# Altium schematic sheet FLUIDIC_CTRL.SchDoc
size 420 x 297 mm; SheetNumber: 17; SheetTotal: 21
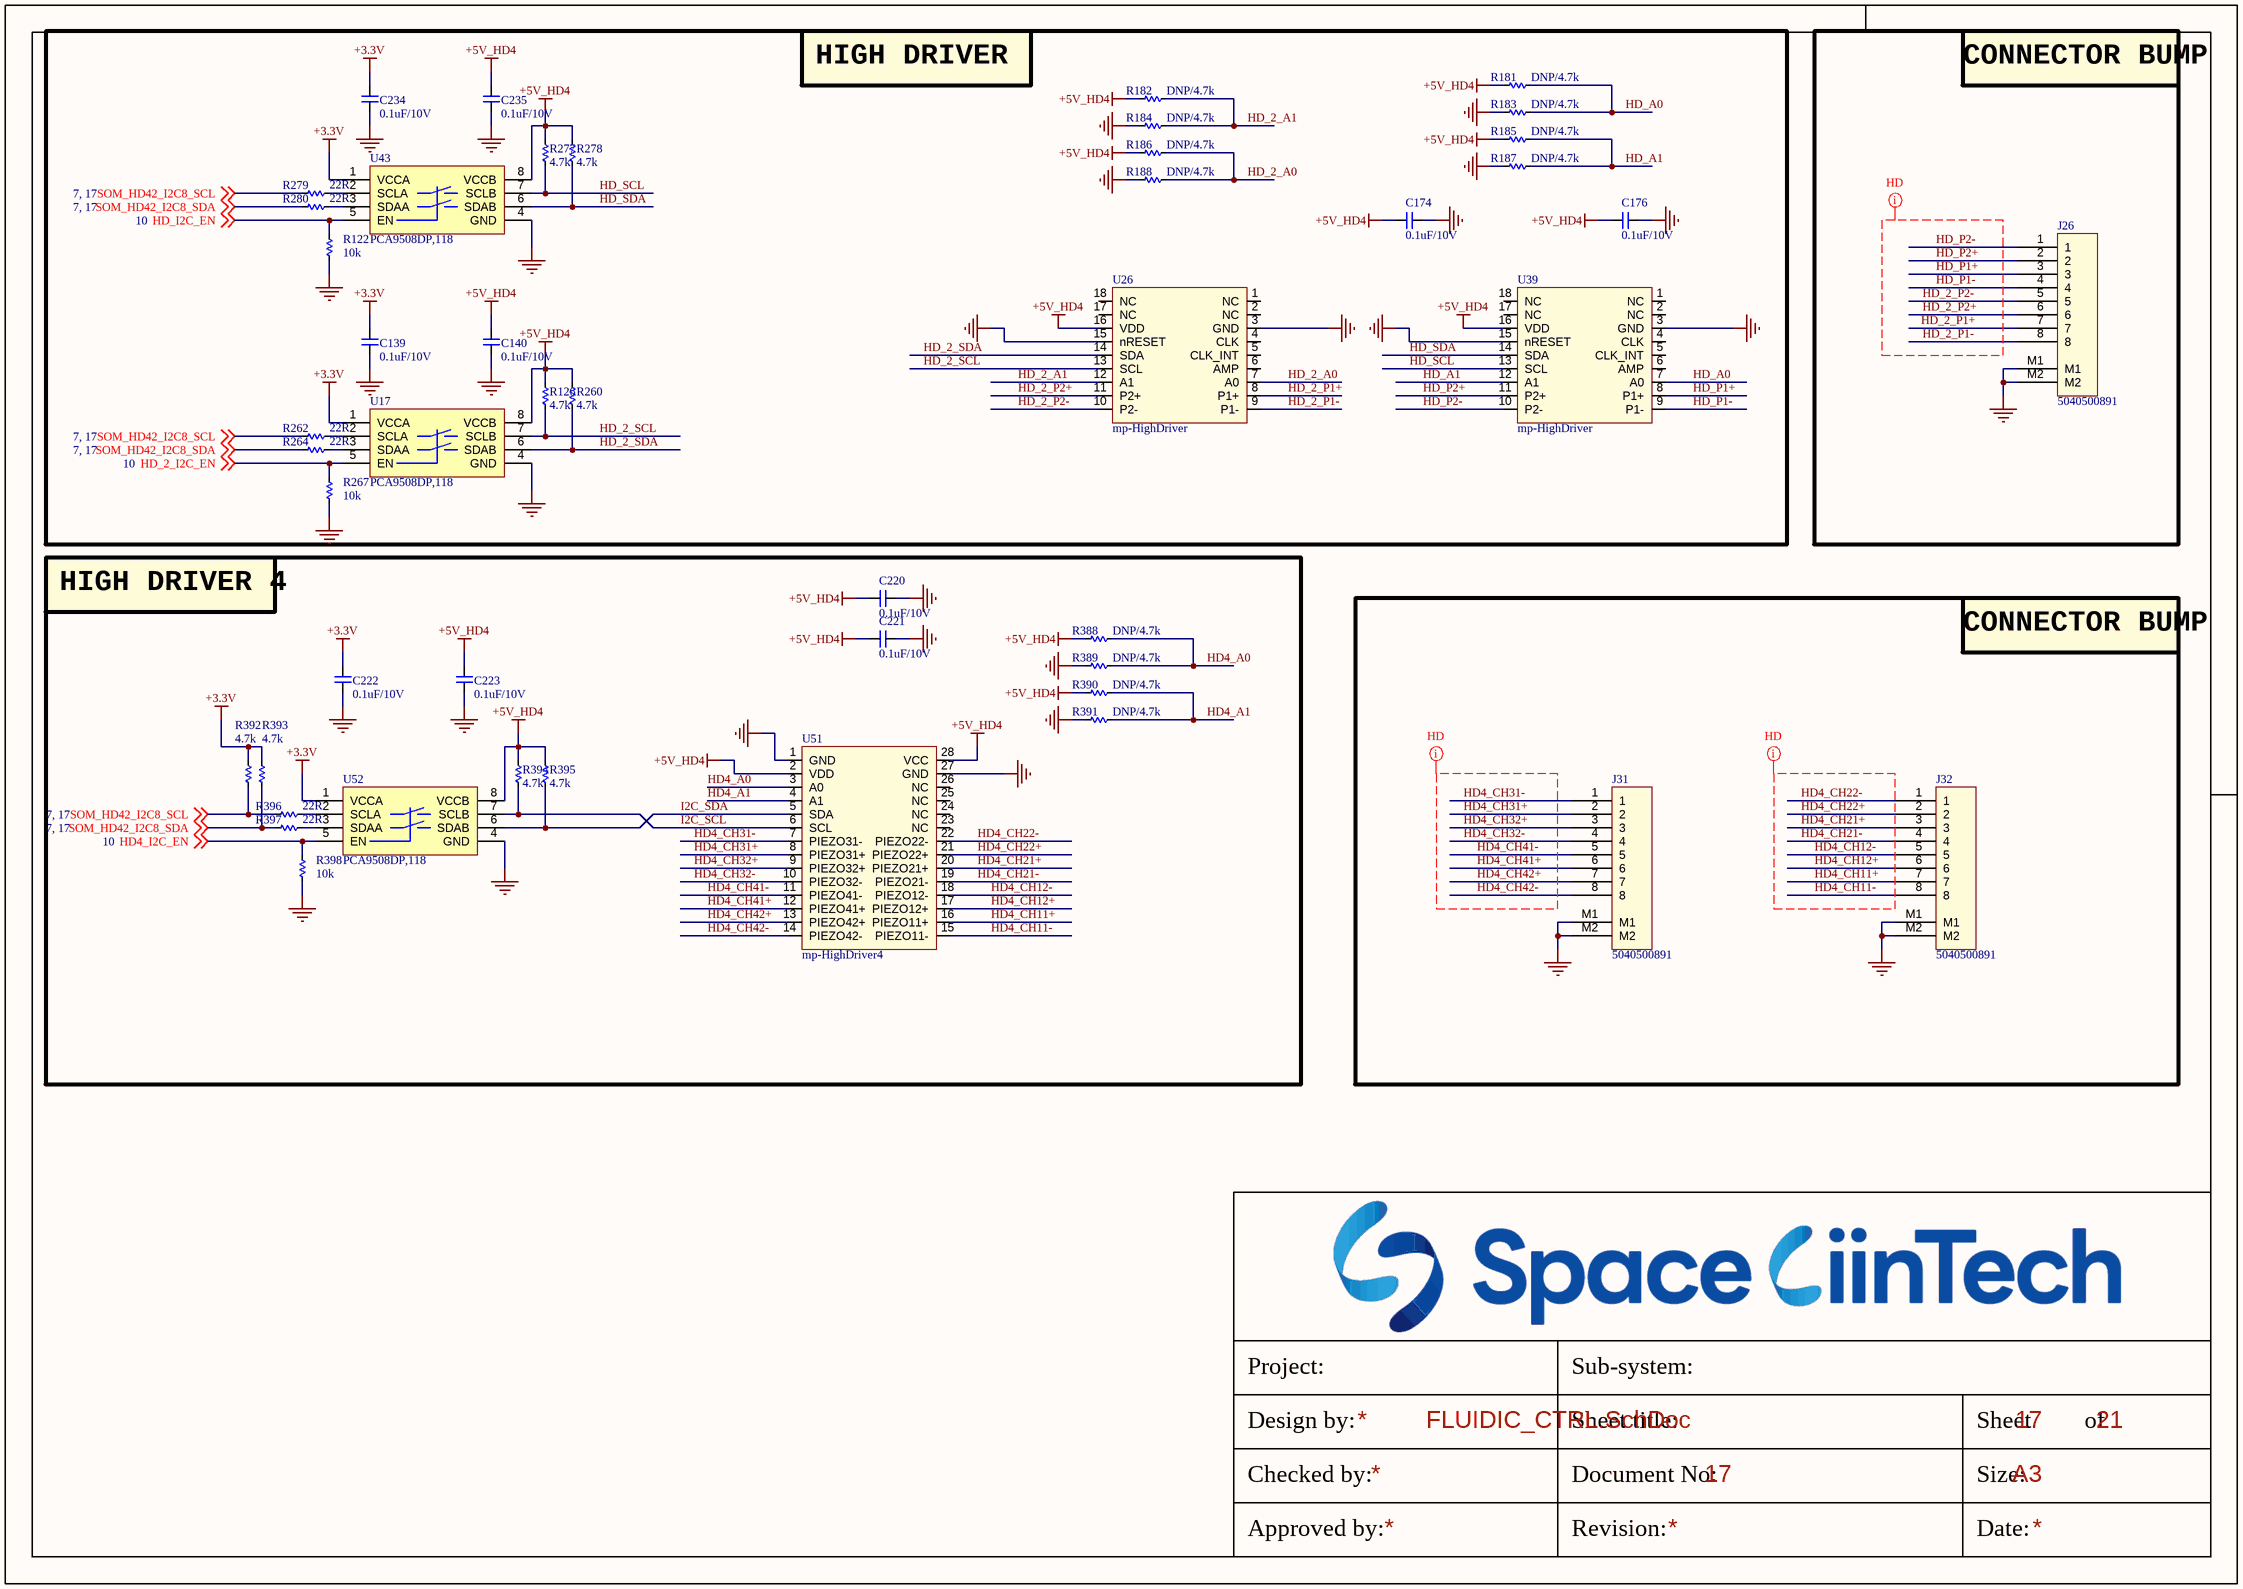
[diagram p0: FLUIDIC_CTRL.SchDoc]

## Parts
C139  0.1uF/10V  [CAP_C_1005X60]
C140  0.1uF/10V  [CAP_C_1005X60]
C174  0.1uF/10V  [CAP_C_1005X60]
C176  0.1uF/10V  [CAP_C_1005X60]
C220  0.1uF/10V  [CAP_C_1005X60]
C221  0.1uF/10V  [CAP_C_1005X60]
C222  0.1uF/10V  [CAP_C_1005X60]
C223  0.1uF/10V  [CAP_C_1005X60]
C234  0.1uF/10V  [CAP_C_1005X60]
C235  0.1uF/10V  [CAP_C_1005X60]
J26  5040500891  [MOLEX_5040500891]
J31  5040500891  [MOLEX_5040500891]
J32  5040500891  [MOLEX_5040500891]
R122  10k  [RES_C_1005X40]
R126  4.7k  [RES_C_1005X40]
R181  DNP/4.7k  [RES_C_1005X40]
R182  DNP/4.7k  [RES_C_1005X40]
R183  DNP/4.7k  [RES_C_1005X40]
R184  DNP/4.7k  [RES_C_1005X40]
R185  DNP/4.7k  [RES_C_1005X40]
R186  DNP/4.7k  [RES_C_1005X40]
R187  DNP/4.7k  [RES_C_1005X40]
R188  DNP/4.7k  [RES_C_1005X40]
R260  4.7k  [RES_C_1005X40]
R262  22R  [RES_C_1005X40]
R264  22R  [RES_C_1005X40]
R267  10k  [RES_C_1005X40]
R277  4.7k  [RES_C_1005X40]
R278  4.7k  [RES_C_1005X40]
R279  22R  [RES_C_1005X40]
R280  22R  [RES_C_1005X40]
R388  DNP/4.7k  [RES_C_1005X40]
R389  DNP/4.7k  [RES_C_1005X40]
R390  DNP/4.7k  [RES_C_1005X40]
R391  DNP/4.7k  [RES_C_1005X40]
R392  4.7k  [RES_C_1005X40]
R393  4.7k  [RES_C_1005X40]
R394  4.7k  [RES_C_1005X40]
R395  4.7k  [RES_C_1005X40]
R396  22R  [RES_C_1005X40]
R397  22R  [RES_C_1005X40]
R398  10k  [RES_C_1005X40]
U17  PCA9508DP,118  [TSOP8]
U26  mp-HighDriver  [MP_HIGHDRIVER]
U39  mp-HighDriver  [MP_HIGHDRIVER]
U43  PCA9508DP,118  [TSOP8]
U51  mp-HighDriver4  [MP_HIGHDRIVER4]
U52  PCA9508DP,118  [TSOP8]

## Blocks framed on the sheet
HIGH DRIVER: C139 C140 C174 C176 C234 C235 R122 R126 R181-R188 R260 R262 R264 R267 R277-R280 U17 U26 U39 U43
CONNECTOR BUMP: J26
HIGH DRIVER 4: C220-C223 R388-R398 U51 U52
CONNECTOR BUMP: J31 J32

## Nets
+3.3V: C139.2 C222.2 C234.2 R392.1 R393.1 U17.1(VCCA) U43.1(VCCA) U52.1(VCCA)
+5V_HD4: C140.2 C174.2 C176.2 C220.2 C221.2 C223.2 C235.2 R126.1 R181.1 R182.1 R185.1 R186.1 R260.1 R277.1 R278.1 R388.1 R390.1 R394.1 R395.1 U17.8(VCCB) U26.16(VDD) U39.16(VDD) U43.8(VCCB) U51.2(VDD) U51.28(VCC) U52.8(VCCB)
GND: C139.1 C140.1 C174.1 C176.1 C220.1 C221.1 C222.1 C223.1 C234.1 C235.1 J26.M1 J26.M2 J31.M1 J31.M2 J32.M1 J32.M2 R122.2 R183.1 R184.1 R187.1 R188.1 R267.2 R389.1 R391.1 R398.2 U17.4(GND) U26.3(GND) U26.15(nRESET) U39.3(GND) U39.15(nRESET) U43.4(GND) U51.1(GND) U51.27(GND) U52.4(GND)
HD4_A0: R388.2 R389.2 U51.3(A0)
HD4_A1: R390.2 R391.2 U51.4(A1)
HD4_CH11+: J32.7 U51.16(PIEZO11+)
HD4_CH11-: J32.8 U51.15(PIEZO11-)
HD4_CH12+: J32.6 U51.17(PIEZO12+)
HD4_CH12-: J32.5 U51.18(PIEZO12-)
HD4_CH21+: J32.3 U51.20(PIEZO21+)
HD4_CH21-: J32.4 U51.19(PIEZO21-)
HD4_CH22+: J32.2 U51.21(PIEZO22+)
HD4_CH22-: J32.1 U51.22(PIEZO22-)
HD4_CH31+: J31.2 U51.8(PIEZO31+)
HD4_CH31-: J31.1 U51.7(PIEZO31-)
HD4_CH32+: J31.3 U51.9(PIEZO32+)
HD4_CH32-: J31.4 U51.10(PIEZO32-)
HD4_CH41+: J31.6 U51.12(PIEZO41+)
HD4_CH41-: J31.5 U51.11(PIEZO41-)
HD4_CH42+: J31.7 U51.13(PIEZO42+)
HD4_CH42-: J31.8 U51.14(PIEZO42-)
HD4_I2C_EN: R398.1 U52.5(EN) ; off-sheet HD4_I2C_EN
HD_2_A0: R186.2 R188.2 U26.7(A0)
HD_2_A1: R182.2 R184.2 U26.12(A1)
HD_2_I2C_EN: R267.1 U17.5(EN) ; off-sheet HD_2_I2C_EN
HD_2_P1+: J26.7 U26.8(P1+)
HD_2_P1-: J26.8 U26.9(P1-)
HD_2_P2+: J26.6 U26.11(P2+)
HD_2_P2-: J26.5 U26.10(P2-)
HD_2_SCL: R126.2 U17.7(SCLB) U26.13(SCL)
HD_2_SDA: R260.2 U17.6(SDAB) U26.14(SDA)
HD_A0: R181.2 R183.2 U39.7(A0)
HD_A1: R185.2 R187.2 U39.12(A1)
HD_I2C_EN: R122.1 U43.5(EN) ; off-sheet HD_I2C_EN
HD_P1+: J26.3 U39.8(P1+)
HD_P1-: J26.4 U39.9(P1-)
HD_P2+: J26.2 U39.11(P2+)
HD_P2-: J26.1 U39.10(P2-)
HD_SCL: R277.2 U39.13(SCL) U43.7(SCLB)
HD_SDA: R278.2 U39.14(SDA) U43.6(SDAB)
I2C_SCL: R394.2 U51.6(SCL) U52.7(SCLB)
I2C_SDA: R395.2 U51.5(SDA) U52.6(SDAB)
SOM_HD42_I2C8_SCL: R262.2 R279.2 R392.2 R396.2 ; off-sheet SOM_HD42_I2C8_SCL
SOM_HD42_I2C8_SDA: R264.2 R280.2 R393.2 R397.2 ; off-sheet SOM_HD42_I2C8_SDA
NetR262_1: R262.1 U17.2(SCLA)
NetR264_1: R264.1 U17.3(SDAA)
NetR279_1: R279.1 U43.2(SCLA)
NetR280_1: R280.1 U43.3(SDAA)
NetR396_1: R396.1 U52.2(SCLA)
NetR397_1: R397.1 U52.3(SDAA)

Not connected (* = marked no-connect by the designer): U26 1(NC) 2(NC) 4(CLK) 5(CLK_INT) 6(AMP) 17(NC) 18(NC); U39 1(NC) 2(NC) 4(CLK) 5(CLK_INT) 6(AMP) 17(NC) 18(NC); U51 23(NC) 24(NC) 25(NC) 26(NC)

## Layout directives
net class HD: HD4_CH11+, HD4_CH11-, HD4_CH12+, HD4_CH12-, HD4_CH21+, HD4_CH21-, HD4_CH22+, HD4_CH22-, HD4_CH31+, HD4_CH31-, HD4_CH32+, HD4_CH32-, HD4_CH41+, HD4_CH41-, HD4_CH42+, HD4_CH42-, HD_2_P1+, HD_2_P1-, HD_2_P2+, HD_2_P2-, HD_P1+, HD_P1-, HD_P2+, HD_P2-

## Notes on the sheet
- Project:
- Sub-system:
- Design by:
- Sheet title:
- Sheet
- of
- Checked by:
- Approved by:
- Revision:
- Document No:
- Size:
- Date:
- A3

## Library data of the parts
C139 C140 C174 C176 C220-C223 C234 C235 = _CAP_C_2: CAP CHIP
J26 J31 J32 = Header 8x1_2M
R122 R126 R181-R188 R260 R262 R264 R267 R277-R280 R388-R398 = _RES_B_2: RES
U51 = mp_HighDriver4